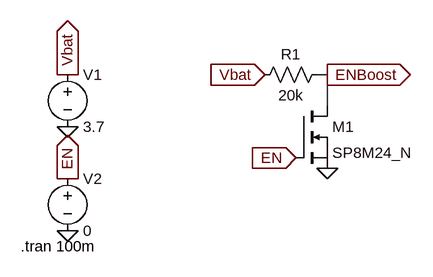
[diagram p0: schematic sim_switch_dc_dc.asc]
sim_switch_dc_dc.asc, the LTspice schematic file:
Version 4
SHEET 1 880 680
WIRE 144 64 128 64
WIRE 144 112 144 64
FLAG 144 208 0
FLAG 96 192 EN
IOPIN 96 192 In
FLAG 144 64 ENBoost
IOPIN 144 64 Out
FLAG 48 64 Vbat
IOPIN 48 64 In
FLAG -256 144 0
FLAG -256 304 0
FLAG -256 64 Vbat
IOPIN -256 64 Out
FLAG -256 224 EN
IOPIN -256 224 Out
SYMBOL nmos 96 112 R0
SYMATTR InstName M1
SYMATTR Value SP8M24_N
SYMBOL res 144 48 R90
WINDOW 0 0 56 VBottom 2
WINDOW 3 32 56 VTop 2
SYMATTR InstName R1
SYMATTR Value 20k
SYMBOL voltage -256 48 R0
WINDOW 123 0 0 Left 0
WINDOW 39 0 0 Left 0
SYMATTR InstName V1
SYMATTR Value 3.7
SYMBOL voltage -256 208 R0
WINDOW 123 0 0 Left 0
WINDOW 39 0 0 Left 0
SYMATTR InstName V2
SYMATTR Value 0
TEXT -328 328 Left 2 !.tran 100m

The netlist it stands for:
* sim_switch_dc_dc.asc
M1 ENBoost EN 0 0 SP8M24_N
R1 ENBoost Vbat 20k
V1 Vbat 0 3.7
V2 EN 0 0
.model NMOS NMOS
.model PMOS PMOS
.lib standard.mos
.tran 100m
.backanno
.end

* Results of the author's LTspice run, read from the files saved beside the schematic
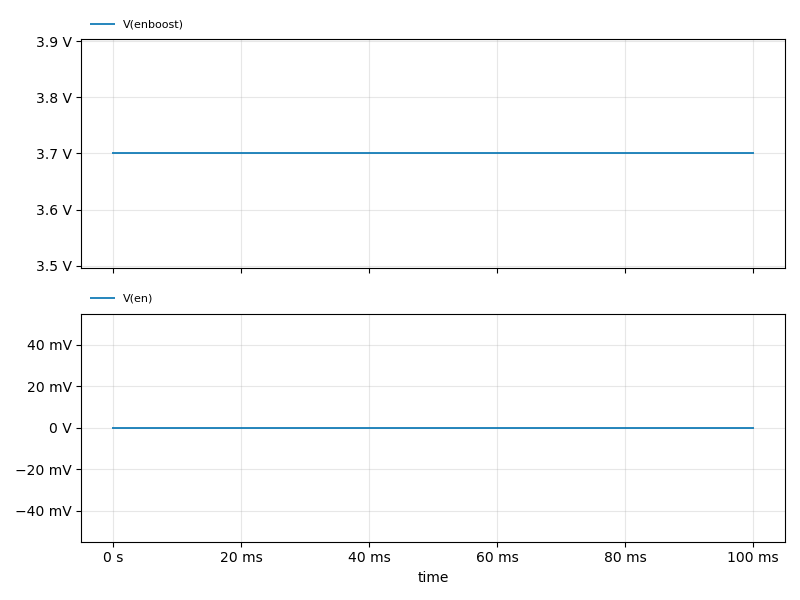
[diagram p1: Transient Analysis of sim_switch_dc_dc.asc, plotted from the saved traces]
* Transient Analysis, 1 run:
*   V(enboost): min 3.7 V, max 3.7 V, average 3.7 V, rms 3.7 V, last 3.7 V
*   V(en): min 0 V, max 0 V, average 0 V, rms 0 V, last 0 V